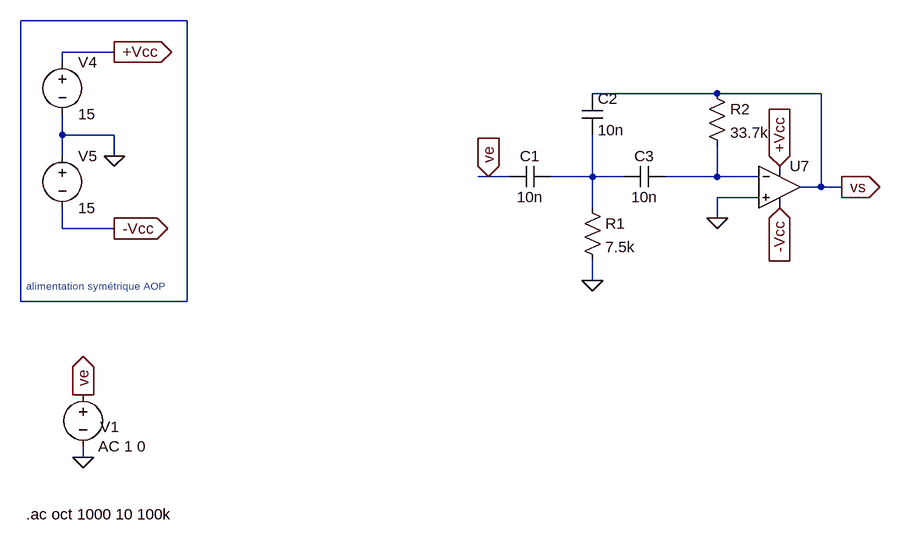
[diagram p0: schematic Rauch_BP.asc]
Rauch_BP.asc, the LTspice schematic file:
Version 4
SHEET 1 2832 788
WIRE -400 -448 -656 -448
WIRE -512 -400 -592 -400
WIRE -592 -384 -592 -400
WIRE 416 -336 224 -336
WIRE 576 -336 416 -336
WIRE -592 -272 -592 -304
WIRE -512 -272 -592 -272
WIRE -592 -240 -592 -272
WIRE -512 -240 -512 -272
WIRE 64 -208 48 -208
WIRE 96 -208 64 -208
WIRE 224 -208 224 -272
WIRE 224 -208 160 -208
WIRE 272 -208 224 -208
WIRE 416 -208 416 -256
WIRE 416 -208 336 -208
WIRE 480 -208 416 -208
WIRE 576 -192 576 -336
WIRE 576 -192 544 -192
WIRE 608 -192 576 -192
WIRE 480 -176 416 -176
WIRE 224 -160 224 -208
WIRE 416 -144 416 -176
WIRE -592 -128 -592 -160
WIRE -512 -128 -592 -128
WIRE 224 -48 224 -80
WIRE -656 -16 -656 -448
WIRE -400 -16 -400 -448
WIRE -400 -16 -656 -16
WIRE -560 224 -560 208
FLAG -560 224 0
FLAG -512 -240 0
FLAG -512 -400 +Vcc
IOPIN -512 -400 Out
FLAG -512 -128 -Vcc
IOPIN -512 -128 Out
FLAG -560 128 ve
IOPIN -560 128 Out
FLAG 512 -224 +Vcc
IOPIN 512 -224 In
FLAG 512 -160 -Vcc
IOPIN 512 -160 In
FLAG 608 -192 vs
IOPIN 608 -192 Out
FLAG 64 -208 ve
IOPIN 64 -208 In
FLAG 416 -144 0
FLAG 224 -48 0
SYMBOL voltage -560 112 R0
WINDOW 123 23 95 Left 2
WINDOW 39 0 0 Left 2
WINDOW 3 -5 162 Left 2
WINDOW 0 26 65 Left 2
SYMATTR Value2 AC 1 0
SYMATTR Value ""
SYMATTR InstName V1
SYMBOL voltage -592 -400 R0
SYMATTR InstName V4
SYMATTR Value 15
SYMBOL voltage -592 -256 R0
SYMATTR InstName V5
SYMATTR Value 15
SYMBOL UniversalOpamp2 512 -192 R0
SYMATTR InstName U7
SYMBOL res 400 -352 R0
SYMATTR InstName R2
SYMATTR Value 33.7k
SYMBOL res 208 -176 R0
SYMATTR InstName R1
SYMATTR Value 7.5k
SYMBOL cap 336 -224 R90
WINDOW 0 0 32 VBottom 2
WINDOW 3 32 32 VTop 2
SYMATTR InstName C3
SYMATTR Value 10n
SYMBOL cap 208 -336 R0
SYMATTR InstName C2
SYMATTR Value 10n
SYMBOL cap 160 -224 R90
WINDOW 0 0 32 VBottom 2
WINDOW 3 32 32 VTop 2
SYMATTR InstName C1
SYMATTR Value 10n
TEXT -648 -40 Left 1 ;alimentation symétrique AOP
TEXT -648 312 Left 2 !.ac oct 1000 10 100k

The netlist it stands for:
* Rauch_BP.asc
V1 ve 0 AC 1 0
V4 +Vcc 0 15
V5 0 -Vcc 15
XU7 0 N003 +Vcc -Vcc vs level.2 Avol=1Meg GBW=10Meg Slew=10Meg ilimit=25m rail=0 Vos=0 phimargin=45 en=0 enk=0 in=0 ink=0 Rin=500Meg  ; pins IN+ IN- V+ V- OUT
R2 vs N003 33.7k
R1 N002 0 7.5k
C3 N003 N002 10n
C2 vs N002 10n
C1 N002 ve 10n
* alimentation symétrique AOP
.ac oct 1000 10 100k
.lib UniversalOpamps2.sub
.backanno
.end